# Altium schematic sheet SchemaAction_Actionneurs.SchDoc: Carte Actionneurs 2024-2025
size A4; DrawnBy: Oriane Doucet; DocumentNumber: 2/2; Revision: V1; SheetNumber: 2; SheetTotal: 2
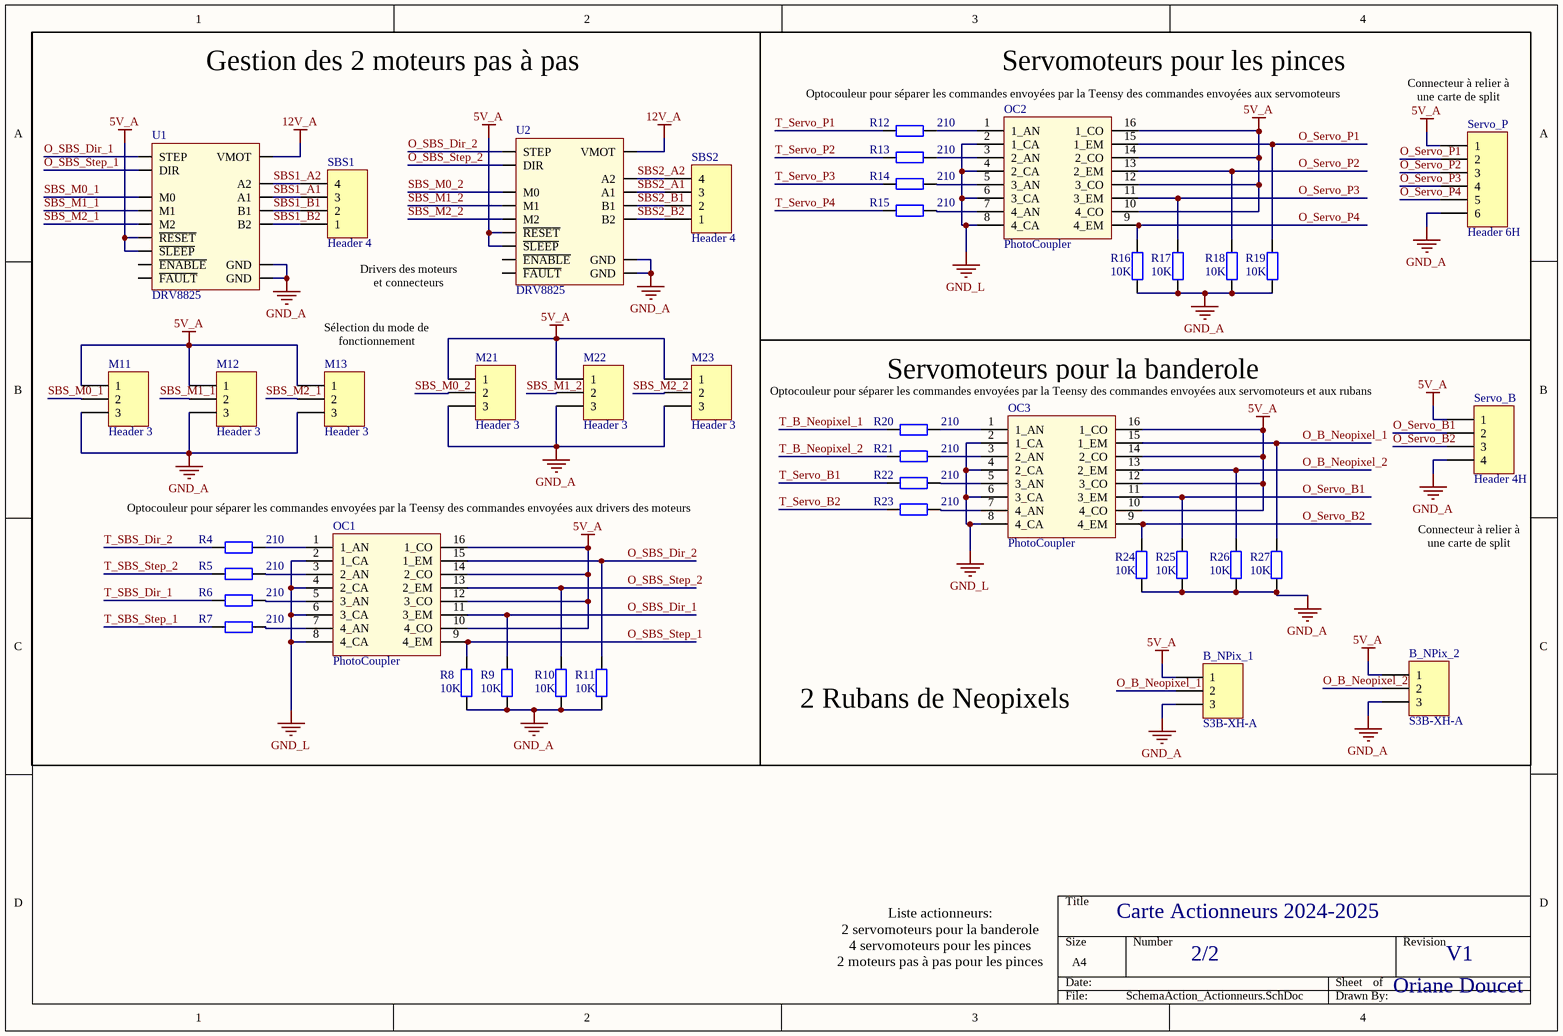
[diagram p0: SchemaAction_Actionneurs.SchDoc]

## Parts
B_NPix_1  S3B-XH-A  [S3B-XH-A]
B_NPix_2  S3B-XH-A  [S3B-XH-A]
M11  Header 3  [HDR1X3]
M12  Header 3  [HDR1X3]
M13  Header 3  [HDR1X3]
M21  Header 3  [HDR1X3]
M22  Header 3  [HDR1X3]
M23  Header 3  [HDR1X3]
OC1  PhotoCoupler  [16 pins SOIC, TI]
OC2  PhotoCoupler  [16 pins SOIC, TI]
OC3  PhotoCoupler  [16 pins SOIC, TI]
R4  value 210  [Resistor 1206]  (hidden comment: Res2)
R5  value 210  [Resistor 1206]  (hidden comment: Res2)
R6  value 210  [Resistor 1206]  (hidden comment: Res2)
R7  value 210  [Resistor 1206]  (hidden comment: Res2)
R8  value 10K  [Resistor 1206]  (hidden comment: Res2)
R9  value 10K  [Resistor 1206]  (hidden comment: Res2)
R10  value 10K  [Resistor 1206]  (hidden comment: Res2)
R11  value 10K  [Resistor 1206]  (hidden comment: Res2)
R12  value 210  [Resistor 1206]  (hidden comment: Res2)
R13  value 210  [Resistor 1206]  (hidden comment: Res2)
R14  value 210  [Resistor 1206]  (hidden comment: Res2)
R15  value 210  [Resistor 1206]  (hidden comment: Res2)
R16  value 10K  [Resistor 1206]  (hidden comment: Res2)
R17  value 10K  [Resistor 1206]  (hidden comment: Res2)
R18  value 10K  [Resistor 1206]  (hidden comment: Res2)
R19  value 10K  [Resistor 1206]  (hidden comment: Res2)
R20  value 210  [Resistor 1206]  (hidden comment: Res2)
R21  value 210  [Resistor 1206]  (hidden comment: Res2)
R22  value 210  [Resistor 1206]  (hidden comment: Res2)
R23  value 210  [Resistor 1206]  (hidden comment: Res2)
R24  value 10K  [Resistor 1206]  (hidden comment: Res2)
R25  value 10K  [Resistor 1206]  (hidden comment: Res2)
R26  value 10K  [Resistor 1206]  (hidden comment: Res2)
R27  value 10K  [Resistor 1206]  (hidden comment: Res2)
SBS1  Header 4  [S4B-XH-A]
SBS2  Header 4  [S4B-XH-A]
Servo_B  Header 4H  [S4B-XH-A]
Servo_P  Header 6H  [S6B-XH-A]
U1  DRV8825  [DRV8825]
U2  DRV8825  [DRV8825]

## Nets
5V_A: B_NPix_1.1 B_NPix_2.1 M11.1 M12.1 M13.1 M21.1 M22.1 M23.1 OC1.10(4_CO) OC1.12(3_CO) OC1.14(2_CO) OC1.16(1_CO) OC2.10(4_CO) OC2.12(3_CO) OC2.14(2_CO) OC2.16(1_CO) OC3.10(4_CO) OC3.12(3_CO) OC3.14(2_CO) OC3.16(1_CO) Servo_B.1 Servo_P.1 U1.5(~{RESET}) U1.6(~{SLEEP}) U2.5(~{RESET}) U2.6(~{SLEEP})
12V_A: U1.16(VMOT) U2.16(VMOT)
GND_A: B_NPix_1.3 B_NPix_2.3 M11.3 M12.3 M13.3 M21.3 M22.3 M23.3 R8.1 R9.1 R10.1 R11.1 R16.1 R17.1 R18.1 R19.1 R24.1 R25.1 R26.1 R27.1 Servo_B.4 Servo_P.6 U1.9(GND) U1.15(GND) U2.9(GND) U2.15(GND)
GND_L: OC1.2(1_CA) OC1.4(2_CA) OC1.6(3_CA) OC1.8(4_CA) OC2.2(1_CA) OC2.4(2_CA) OC2.6(3_CA) OC2.8(4_CA) OC3.2(1_CA) OC3.4(2_CA) OC3.6(3_CA) OC3.8(4_CA)
O_B_Neopixel_1: B_NPix_1.2 OC3.15(1_EM) R27.2
O_B_Neopixel_2: B_NPix_2.2 OC3.13(2_EM) R26.2
O_SBS_Dir_1: OC1.11(3_EM) R9.2 U1.7(STEP)
O_SBS_Dir_2: OC1.15(1_EM) R11.2 U2.7(STEP)
O_SBS_Step_1: OC1.9(4_EM) R8.2 U1.8(DIR)
O_SBS_Step_2: OC1.13(2_EM) R10.2 U2.8(DIR)
O_Servo_B1: OC3.11(3_EM) R25.2 Servo_B.2
O_Servo_B2: OC3.9(4_EM) R24.2 Servo_B.3
O_Servo_P1: OC2.15(1_EM) R19.2 Servo_P.2
O_Servo_P2: OC2.13(2_EM) R18.2 Servo_P.3
O_Servo_P3: OC2.11(3_EM) R17.2 Servo_P.4
O_Servo_P4: OC2.9(4_EM) R16.2 Servo_P.5
SBS1_A1: SBS1.3 U1.12(A1)
SBS1_A2: SBS1.4 U1.11(A2)
SBS1_B1: SBS1.2 U1.13(B1)
SBS1_B2: SBS1.1 U1.14(B2)
SBS2_A1: SBS2.3 U2.12(A1)
SBS2_A2: SBS2.4 U2.11(A2)
SBS2_B1: SBS2.2 U2.13(B1)
SBS2_B2: SBS2.1 U2.14(B2)
SBS_M0_1: M11.2 U1.2(M0)
SBS_M0_2: M21.2 U2.2(M0)
SBS_M1_1: M12.2 U1.3(M1)
SBS_M1_2: M22.2 U2.3(M1)
SBS_M2_1: M13.2 U1.4(M2)
SBS_M2_2: M23.2 U2.4(M2)
T_B_Neopixel_1: R20.2
T_B_Neopixel_2: R21.2
T_SBS_Dir_1: R6.2
T_SBS_Dir_2: R4.2
T_SBS_Step_1: R7.2
T_SBS_Step_2: R5.2
T_Servo_B1: R22.2
T_Servo_B2: R23.2
T_Servo_P1: R12.2
T_Servo_P2: R13.2
T_Servo_P3: R14.2
T_Servo_P4: R15.2
NetOC1_1: OC1.1(1_AN) R4.1
NetOC1_3: OC1.3(2_AN) R5.1
NetOC1_5: OC1.5(3_AN) R6.1
NetOC1_7: OC1.7(4_AN) R7.1
NetOC2_1: OC2.1(1_AN) R12.1
NetOC2_3: OC2.3(2_AN) R13.1
NetOC2_5: OC2.5(3_AN) R14.1
NetOC2_7: OC2.7(4_AN) R15.1
NetOC3_1: OC3.1(1_AN) R20.1
NetOC3_3: OC3.3(2_AN) R21.1
NetOC3_5: OC3.5(3_AN) R22.1
NetOC3_7: OC3.7(4_AN) R23.1

Not connected (* = marked no-connect by the designer): U1 1(~{ENABLE}) 10(~{FAULT}); U2 1(~{ENABLE}) 10(~{FAULT})

## Notes on the sheet
- Gestion des 2 moteurs pas à pas
- Optocouleur pour séparer les commandes envoyées par la Teensy des commandes envoyées aux servomoteurs
- Servomoteurs pour les pinces
- (near Servo_P) Connecteur à relier à une carte de split
- Drivers des moteurs et connecteurs
- Sélection du mode de fonctionnement
- Servomoteurs pour la banderole
- Optocouleur pour séparer les commandes envoyées par la Teensy des commandes envoyées aux servomoteurs et aux rubans
- Optocouleur pour séparer les commandes envoyées par la Teensy des commandes envoyées aux drivers des moteurs
- Connecteur à relier à une carte de split
- 2 Rubans de Neopixels
- Liste actionneurs:
  2 servomoteurs pour la banderole
  4 servomoteurs pour les pinces
  2 moteurs pas à pas pour les pinces

## Library data of the parts
B_NPix_1 B_NPix_2 = Header 3H: Header, 3-Pin, Right Angle; LatestRevisionDate: 17-Jul-2002; LatestRevisionNote: Re-released for DXP Platform.; Publisher: Altium Limited
M11-M13 M21-M23 = Header 3: Header, 3-Pin; LatestRevisionDate: 17-Jul-2002; LatestRevisionNote: Re-released for DXP Platform.; Publisher: Altium Limited
OC1-OC3 = LTV-247: Integrated Circuit; Manufacturer_Name: Lite-On; Datasheet Link: http://optoelectronics.liteon.com/upload/download/DS70-2009-0014/LTV-2X7%20sereis%20Mar17.PDF; Manufacturer_Part_Number: LTV-247; Mouser Part Number: 859-LTV-247; Mouser Price/Stock: https://www.mouser.co.uk/ProductDetail/Lite-On/LTV-247/?qs=9ayhpukWNmvWpoxQBzWkFA%3D%3D; Arrow Part Number: LTV-247; Arrow Price/Stock: https://www.arrow.com/en/products/ltv-247/lite-on-technology
R4-R27 = Res2: Resistor; Published: 8-Jun-2000; LatestRevisionDate: 17-Jul-2002; LatestRevisionNote: Re-released for DXP Platform.; PackageReference: AXIAL-0.4; Publisher: Altium Limited; PackageDescription: Axial Device, Thru-Hole; 2 Leads; 0.4 in Pin Spacing
SBS1 SBS2 = Header 4: Header, 4-Pin; LatestRevisionDate: 17-Jul-2002; LatestRevisionNote: Re-released for DXP Platform.; Publisher: Altium Limited
Servo_B = Header 4H: Header, 4-Pin, Right Angle; LatestRevisionDate: 17-Jul-2002; LatestRevisionNote: Re-released for DXP Platform.; Publisher: Altium Limited
Servo_P = Header 6H: Header, 6-Pin, Right Angle; LatestRevisionDate: 17-Jul-2002; LatestRevisionNote: Re-released for DXP Platform.; Publisher: Altium Limited
U1 U2 = DRV8825: Stepper Driver Module